# Altium schematic sheet currgenTPA.SchDoc
size A4
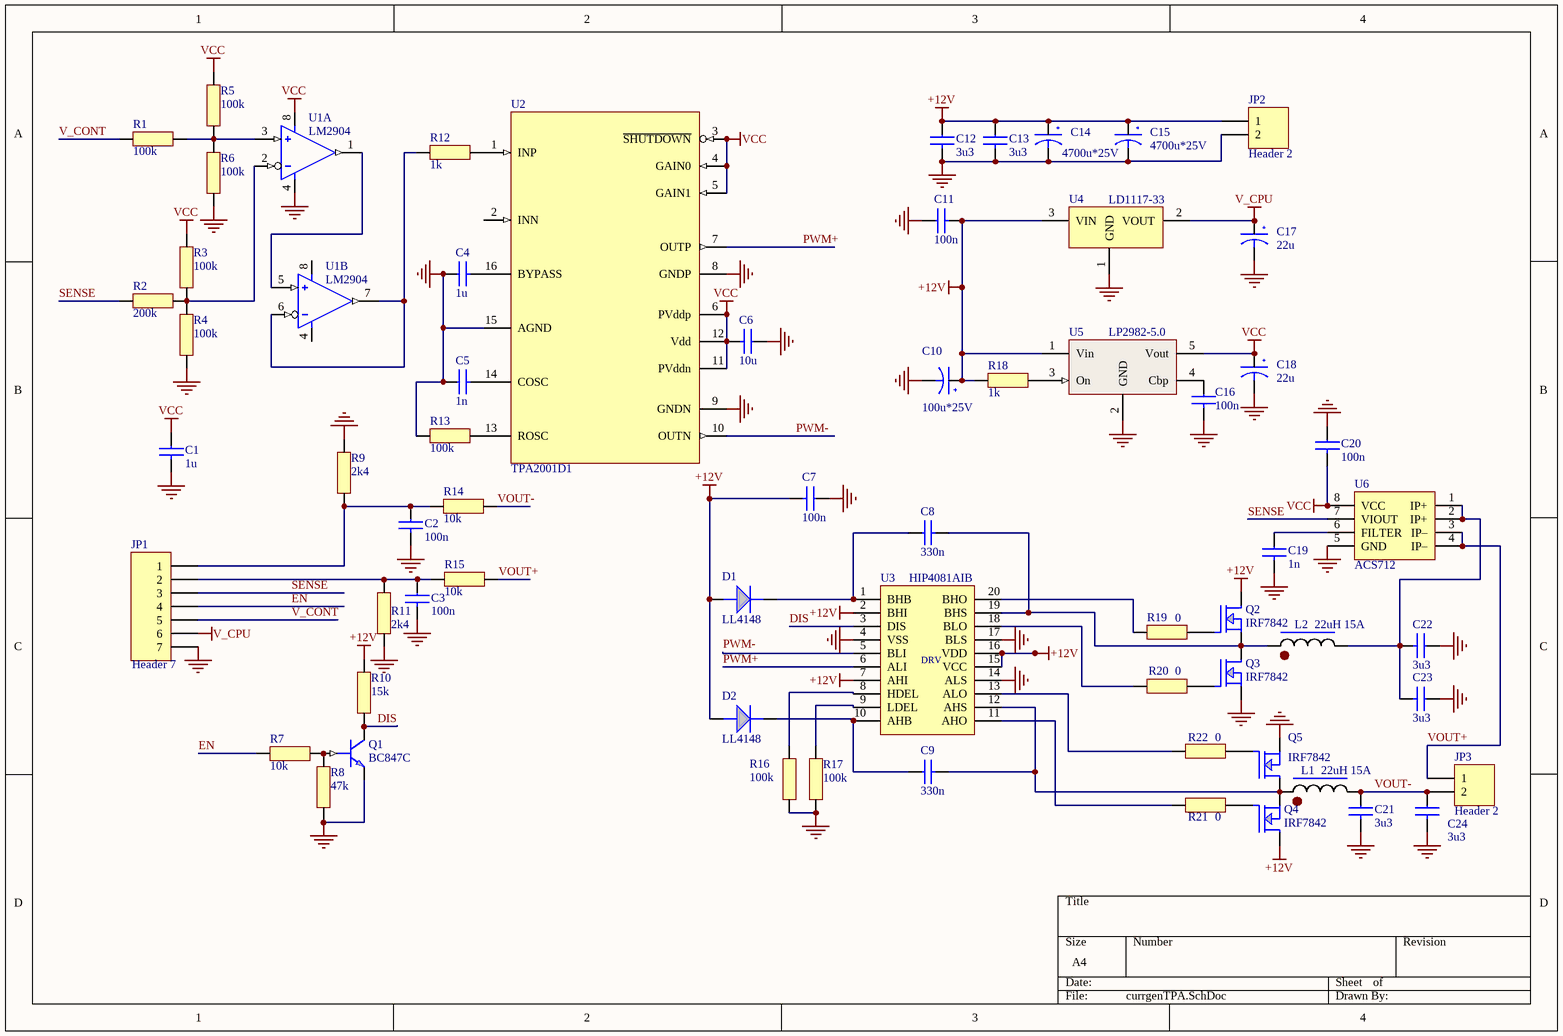
[diagram p0: currgenTPA.SchDoc]

## Parts
C1  1u  [C-0805]
C2  100n  [C-0805]
C3  100n  [C-0805]
C4  1u  [C-0805]
C5  1n  [C-0805]
C6  10u  [C-0805]
C7  100n  [C-0805]
C8  330n  [C-0805]
C9  330n  [C-0805]
C10  100u*25V  [EXR-6.3X11]
C11  100n  [C-0805]
C12  3u3  [C-1206]
C13  3u3  [C-1206]
C14  4700u*25V  [EXR-10X12.5]
C15  4700u*25V  [EXR-10X12.5]
C16  100n  [C-0805]
C17  22u  [TANTAL-A]
C18  22u  [TANTAL-A]
C19  1n  [C-0805]
C20  100n  [C-0805]
C21  3u3  [C-1206]
C22  3u3  [C-1206]
C23  3u3  [C-1206]
C24  3u3  [C-1206]
D1  LL4148  [SOD-80]
D2  LL4148  [SOD-80]
JP1  Header 7  [HDR1X7]
JP2  Header 2  [KLEMMA2]
JP3  Header 2  [KLEMMA2]
L1  22uH 15A  [L_TOR]
L2  22uH 15A  [L_TOR]
Q1  BC847C  [SOT-23]
Q2  IRF7842  [SO8_MOSFET]
Q3  IRF7842  [SO8_MOSFET]
Q4  IRF7842  [SO8_MOSFET]
Q5  IRF7842  [SO8_MOSFET]
R1  100k  [R-0805]
R2  200k  [R-0805]
R3  100k  [R-0805]
R4  100k  [R-0805]
R5  100k  [R-0805]
R6  100k  [R-0805]
R7  10k  [R-0805]
R8  47k  [R-0805]
R9  2k4  [R-0805]
R10  15k  [R-0805]
R11  2k4  [R-0805]
R12  1k  [R-0805]
R13  100k  [R-0805]
R14  10k  [R-0805]
R15  10k  [R-0805]
R16  100k  [R-0805]
R17  100k  [R-0805]
R18  1k  [R-0805]
R19  0  [R-0805]
R20  0  [R-0805]
R21  0  [R-0805]
R22  0  [R-0805]
U1  LM2904  [SO8-(SOT-96-1)]  (parts A,B of 2)
U2  TPA2001D1  [TSSOP16-(SOT-403-1)]
U3  HIP4081AIB  [SO20-(SOT-163-1)]
U4  LD1117-33  [SOT-223-(SC-73)]
U5  LP2982-5.0  [SOT-23-5]
U6  ACS712  [SO8-(SOT-96-1)]

## Nets
2: U4.4(VOUT)
+12V: C7.2 C10.2(+) C11.2 C12.1 C13.1 C14.2(+) C15.2(+) D1.A D2.A JP2.1 Q2.5(DRAIN) Q4.5(DRAIN) R10.1 R18.1 U3.2(BHI) U3.7(AHI) U3.15(VCC) U3.16(VDD) U4.3(VIN) U5.1(Vin)
GND: C1.2 C2.2 C3.2 C4.1 C5.1 C6.1 C7.1 C10.1(-) C11.1 C12.2 C13.2 C14.1(-) C15.1(-) C16.2 C17.1(-) C18.1(-) C19.2 C20.1 C21.2 C22.1 C23.1 C24.2 JP1.7 JP2.2 Q1.1(EMITTER) Q3.1(SOURCE) Q5.1(SOURCE) R4.2 R6.2 R8.2 R9.1 R11.2 R13.2 R16.1 R17.1 U1.4(V-) U2.8(GNDP) U2.9(GNDN) U2.15(AGND) U3.4(VSS) U3.14(ALS) U3.17(BLS) U4.1(GND) U5.2(GND) U6.5(GND)
V_CPU: C17.2(+) JP1.6 U4.2(VOUT)
VCC: C1.1 C6.2 C18.2(+) C20.2 R3.1 R5.1 U1.8(V+) U2.3(~{SHUTDOWN}) U2.4(GAIN0) U2.5(GAIN1) U2.6(PVddp) U2.11(PVddn) U2.12(Vdd) U5.5(Vout) U6.8(VCC)
DIS: Q1.3(COLLECTOR) R10.2 U3.3(DIS)
EN: JP1.4 R7.1
PWM+: U2.7(OUTP) U3.6(ALI)
PWM-: U2.10(OUTN) U3.5(BLI)
SENSE: JP1.3 R2.1 U6.7(VIOUT)
V_CONT: JP1.5 R1.1
VOUT+: JP3.1 R15.2 U6.3(IP–) U6.4(IP–)
VOUT-: C21.1 C24.1 JP3.2 L1.2 R14.2
NetC2_1: C2.1 JP1.1 R9.2 R14.1
NetC3_1: C3.1 JP1.2 R11.1 R15.1
NetC4_2: C4.2 U2.16(BYPASS)
NetC5_2: C5.2 U2.14(COSC)
NetC8_1: C8.1 D1.K U3.1(BHB)
NetC8_2: C8.2 L2.1 Q2.1(SOURCE) Q3.5(DRAIN) U3.19(BHS)
NetC9_1: C9.1 D2.K U3.10(AHB)
NetC9_2: C9.2 L1.1 Q4.1(SOURCE) Q5.5(DRAIN) U3.12(AHS)
NetC16_1: C16.1 U5.4(Cbp)
NetC19_1: C19.1 U6.6(FILTER)
NetC22_2: C22.2 C23.2 L2.2 U6.1(IP+) U6.2(IP+)
NetQ1_2: Q1.2(BASE) R7.2 R8.1
NetQ2_4: Q2.4(GATE) R19.2
NetQ3_4: Q3.4(GATE) R20.2
NetQ4_4: Q4.4(GATE) R21.2
NetQ5_4: Q5.4(GATE) R22.2
NetR1_2: R1.2 R5.2 R6.1 U1.3(+IN)
NetR2_2: R2.2 R3.2 R4.1 U1.2(-IN)
NetR12_1: R12.1 U1.6(-IN) U1.7(OUT)
NetR12_2: R12.2 U2.1(INP)
NetR13_1: R13.1 U2.13(ROSC)
NetR16_2: R16.2 U3.8(HDEL)
NetR17_2: R17.2 U3.9(LDEL)
NetR18_2: R18.2 U5.3(On)
NetR19_1: R19.1 U3.20(BHO)
NetR20_1: R20.1 U3.18(BLO)
NetR21_1: R21.1 U3.11(AHO)
NetR22_1: R22.1 U3.13(ALO)
NetU1_1: U1.1(OUT) U1.5(+IN)

Not connected (* = marked no-connect by the designer): U2 2(INN)

## Notes on the sheet
- (in symbol HIP4081AIB) DRV

## Library data of the parts
C1-C9 C11-C13 C16 C19-C24 = C: Производитель: *; Точность: *; Напряжение: *; Тип диэлектрика: *
C10 C14 C15 = C-EL-DIP: Производитель: *; Точность: *; Напряжение: *; Тип диэлектрика: *
C17 C18 = C-EL-TAN: Производитель: *; Точность: *; Напряжение: *; Тип диэлектрика: *
D1 D2 = DIODE
JP1 = Header 7: Header, 7-Pin; LatestRevisionDate: 17-Jul-2002; LatestRevisionNote: Re-released for DXP Platform.; Publisher: Altium Limited
JP2 JP3 = Header 2: Header, 2-Pin; LatestRevisionDate: 17-Jul-2002; LatestRevisionNote: Re-released for DXP Platform.; Publisher: Altium Limited
L1 L2 = L*
Q1 = NPN
R1-R22 = R: Производитель: *; Точность: *; Тип: *
U1 = LM2904: 2 Operation amplifier; Производитель: *; Допустимая замена: *; Цена: *; PDF файл: *; Температурный диапазон: *
U2 = TPA2001D1: 1-W FILTERLESS MONO AUDIO POWER AMPLIFIER; Производитель: *; Допустимая замена: *; Цена: *; PDF файл: *; Температурный диапазон: *
U4 = LD1117
U5 = LP2982: 50mA Ultra Low-Dropout Regulator; Производитель: *; Допустимая замена: *; Цена: *; PDF файл: *; Температурный диапазон: *